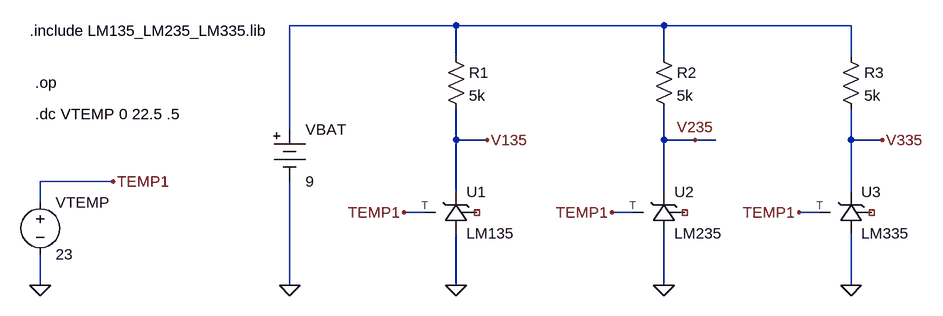
[diagram p0: schematic LM335_LM235_LM135_test.asc]
LM335_LM235_LM135_test.asc, the LTspice schematic file:
Version 4
SHEET 1 1248 680
WIRE 512 -176 256 -176
WIRE 832 -176 512 -176
WIRE 1120 -176 832 -176
WIRE 512 -128 512 -176
WIRE 832 -128 832 -176
WIRE 1120 -128 1120 -176
WIRE 256 -16 256 -176
WIRE 512 0 512 -48
WIRE 560 0 512 0
WIRE 832 0 832 -48
WIRE 880 0 832 0
WIRE 912 0 880 0
WIRE 1120 0 1120 -48
WIRE 1168 0 1120 0
WIRE -16 64 -128 64
WIRE 512 80 512 0
WIRE 832 80 832 0
WIRE 1120 80 1120 0
WIRE -128 96 -128 64
WIRE 464 112 432 112
WIRE 784 112 752 112
WIRE 1072 112 1040 112
WIRE -128 224 -128 176
WIRE 256 224 256 64
WIRE 512 224 512 144
WIRE 832 224 832 144
WIRE 1120 224 1120 144
FLAG -128 224 0
FLAG -16 64 TEMP1
FLAG 432 112 TEMP1
FLAG 560 0 V135
FLAG 512 224 0
FLAG 752 112 TEMP1
FLAG 880 0 V235
FLAG 832 224 0
FLAG 1040 112 TEMP1
FLAG 1168 0 V335
FLAG 1120 224 0
FLAG 256 224 0
SYMBOL voltage -128 80 R0
WINDOW 123 0 0 Left 0
WINDOW 39 0 0 Left 0
SYMATTR InstName VTEMP
SYMATTR Value 23
SYMBOL res 496 -144 R0
SYMATTR InstName R1
SYMATTR Value 5k
SYMBOL Misc\\battery 256 -32 R0
WINDOW 123 0 0 Left 0
WINDOW 39 0 0 Left 0
SYMATTR InstName VBAT
SYMATTR Value 9
SYMBOL lm335 496 80 R0
SYMATTR InstName U1
SYMATTR Value LM135
SYMBOL res 816 -144 R0
SYMATTR InstName R2
SYMATTR Value 5k
SYMBOL lm335 816 80 R0
SYMATTR InstName U2
SYMATTR Value LM235
SYMBOL res 1104 -144 R0
SYMATTR InstName R3
SYMATTR Value 5k
SYMBOL lm335 1104 80 R0
SYMATTR InstName U3
TEXT -136 -88 Left 0 !.op
TEXT -136 -40 Left 0 !.dc VTEMP 0 22.5 .5
TEXT -144 -168 Left 0 !.include LM135_LM235_LM335.lib

The netlist it stands for:
* LM335_LM235_LM135_test.asc
VTEMP TEMP1 0 23
R1 N001 V135 5k
VBAT N001 0 9
XU1 0 V135 NC_01 TEMP1 LM135  ; pins A K ADJ T
R2 N001 V235 5k
XU2 0 V235 NC_02 TEMP1 LM235  ; pins A K ADJ T
R3 N001 V335 5k
XU3 0 V335 NC_03 TEMP1 LM335  ; pins A K ADJ T
.op
.dc VTEMP 0 22.5 .5
.include LM135_LM235_LM335.lib
.backanno
.end